# Altium schematic sheet CAN.SchDoc
size A
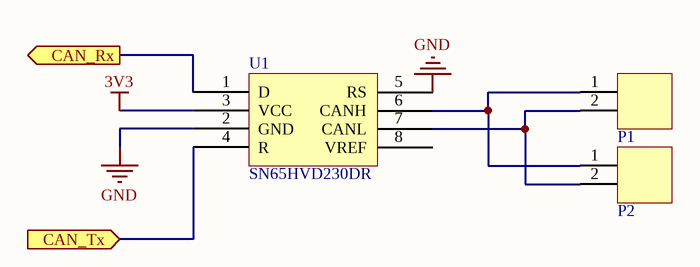
[diagram p0: CAN.SchDoc]

## Parts
P1  2-pin Horz Sherlock  [MOLEX-HDR-1X2-SHERLOCK-HORZ]  (value not drawn)
P2  2-pin Horz Sherlock  [MOLEX-HDR-1X2-SHERLOCK-HORZ]  (value not drawn)
U1  SN65HVD230DR  [SOIC-8pin]

## Ports
CAN_Rx (out), CAN_Tx (in)

## Nets
3V3: U1.3(VCC)
GND: U1.2(GND) U1.5(RS)
CAN_Rx: U1.1(D) ; port CAN_Rx
CAN_Tx: U1.4(R) ; port CAN_Tx
NetP1_1: P1.1 P2.1 U1.6(CANH)
NetP1_2: P1.2 P2.2 U1.7(CANL)

Not connected (* = marked no-connect by the designer): U1 8(VREF)

## Library data of the parts
P1 P2 = MOLEX-HDR-1x2-SHERLOCK_RA: Header, Molex, 2mm Pitch Sherlock Header, Single Row, Horizontal, 2 Circuits, Length 3.3mm,  0353630260; Manufacturer: Molex Inc; Manufacturer Part Number: 0353630260; Supplier Part Number 1: WM18931-ND; Supplier 1: Digi-Key
U1 = SN65HVD230DR: IC TXRX CAN 1MBPS 3.3V 8SOIC; Supplier 1: Digi-Key; Supplier Part Numbe 1: 296-11654-1-ND